# EAGLE design 6x5keyboard (EAGLE 6.5.0)
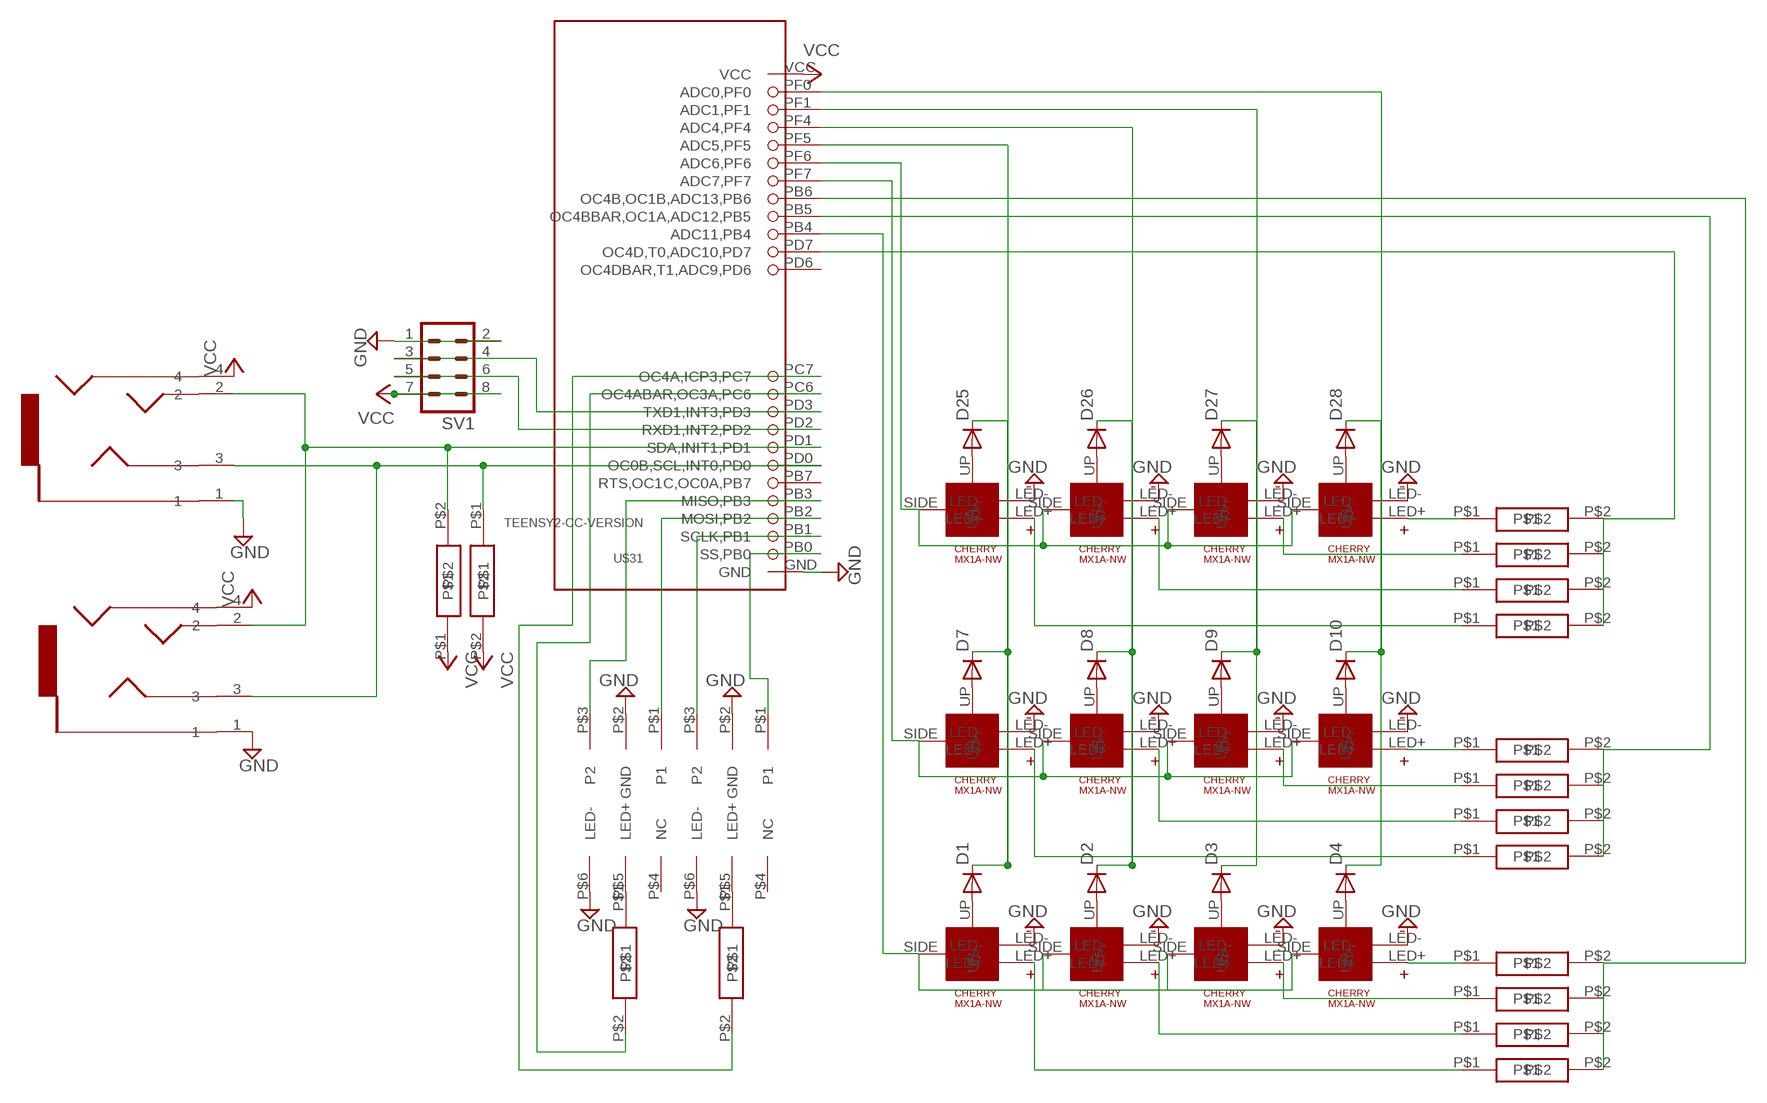
[diagram p0: schematic, sheet 1]

## Parts
COMM  SJ-43514_HEADPHONES_3.5MM_X4  [SJ-43514_HEADPHONES-3.5MM_X4]
COMM1  SJ-43514_HEADPHONES_3.5MM_X4  [SJ-43514_HEADPHONES-3.5MM_X4]
D1  1N4148DO35-7  [DO35-7]
D2  1N4148DO35-7  [DO35-7]
D3  1N4148DO35-7  [DO35-7]
D4  1N4148DO35-7  [DO35-7]
D7  1N4148DO35-7  [DO35-7]
D8  1N4148DO35-7  [DO35-7]
D9  1N4148DO35-7  [DO35-7]
D10  1N4148DO35-7  [DO35-7]
D25  1N4148DO35-7  [DO35-7]
D26  1N4148DO35-7  [DO35-7]
D27  1N4148DO35-7  [DO35-7]
D28  1N4148DO35-7  [DO35-7]
SV1  MA04-2  [MA04-2]
U$1  CHERRY-MX1A-E1NW-LED  [CHERRYMX-NN-LED]
U$2  CHERRY-MX1A-E1NW-LED  [CHERRYMX-NN-LED]
U$3  CHERRY-MX1A-E1NW-LED  [CHERRYMX-NN-LED]
U$4  CHERRY-MX1A-E1NW-LED  [CHERRYMX-NN-LED]
U$5  RESISTORBIGPAD  [RESISTORBIGPAD]
U$6  RESISTORBIGPAD  [RESISTORBIGPAD]
U$7  CHERRY-MX1A-E1NW-LED  [CHERRYMX-NN-LED]
U$8  CHERRY-MX1A-E1NW-LED  [CHERRYMX-NN-LED]
U$9  CHERRY-MX1A-E1NW-LED  [CHERRYMX-NN-LED]
U$10  CHERRY-MX1A-E1NW-LED  [CHERRYMX-NN-LED]
U$11  RESISTORBIGPAD  [RESISTORBIGPAD]
U$12  RESISTORBIGPAD  [RESISTORBIGPAD]
U$13  RESISTORBIGPAD  [RESISTORBIGPAD]
U$14  RESISTORBIGPAD  [RESISTORBIGPAD]
U$15  RESISTORBIGPAD  [RESISTORBIGPAD]
U$16  RESISTORBIGPAD  [RESISTORBIGPAD]
U$17  RESISTORBIGPAD  [RESISTORBIGPAD]
U$18  RESISTORBIGPAD  [RESISTORBIGPAD]
U$19  RESISTORBIGPAD  [RESISTORBIGPAD]
U$20  RESISTORBIGPAD  [RESISTORBIGPAD]
U$21  RESISTORBIGPAD  [RESISTORBIGPAD]
U$22  RESISTORBIGPAD  [RESISTORBIGPAD]
U$23  NKK_GW_SERIES  [NKK_GW_SERIES]
U$24  NKK_GW_SERIES  [NKK_GW_SERIES]
U$25  CHERRY-MX1A-E1NW-LED  [CHERRYMX-NN-LED]
U$26  CHERRY-MX1A-E1NW-LED  [CHERRYMX-NN-LED]
U$27  CHERRY-MX1A-E1NW-LED  [CHERRYMX-NN-LED]
U$28  CHERRY-MX1A-E1NW-LED  [CHERRYMX-NN-LED]
U$29  RESISTORBIGPAD  [RESISTORBIGPAD]
U$30  RESISTORBIGPAD  [RESISTORBIGPAD]
U$31  TEENSY2-CC-VERSION  [TEENSY2]

## Nets
GND: COMM1.1 COMM.1 SV1.1 SV1.2 U$1.LED- U$2.LED- U$3.LED- U$4.LED- U$7.LED- U$8.LED- U$9.LED- U$10.LED- U$23.P$2(GND) U$23.P$6(LED-) U$24.P$2(GND) U$24.P$6(LED-) U$25.LED- U$26.LED- U$27.LED- U$28.LED- U$31.GND
N$1: D1.A U$2.UP
N$2: D2.A U$1.UP
N$3: D3.A U$3.UP
N$4: D4.A U$4.UP
N$5: U$4.LED+ U$12.P$1
N$6: U$23.P$5(LED+) U$29.P$1
N$7: D7.A U$7.UP
N$8: D8.A U$8.UP
N$9: D9.A U$9.UP
N$10: D10.A U$10.UP
N$11: U$3.LED+ U$11.P$1
N$12: U$1.LED+ U$6.P$1
N$13: U$2.LED+ U$5.P$1
N$14: U$30.P$2 U$31.PC7(OC4A,ICP3,PC7)
N$15: U$24.P$5(LED+) U$30.P$1
N$16: COMM1.2 COMM.2 U$21.P$2 U$31.PD1(SDA,INIT1,PD1)
N$17: U$29.P$2 U$31.PC6(OC4ABAR,OC3A,PC6)
N$18: U$10.LED+ U$13.P$1
N$19: U$9.LED+ U$14.P$1
N$20: U$8.LED+ U$15.P$1
N$21: U$7.LED+ U$16.P$1
N$22: U$24.P$1(P1) U$31.PB0(SS,PB0)
N$23: U$17.P$1 U$28.LED+
N$24: U$18.P$1 U$27.LED+
N$25: D25.A U$25.UP
N$26: D26.A U$26.UP
N$27: D27.A U$27.UP
N$28: D28.A U$28.UP
N$29: U$19.P$1 U$26.LED+
N$30: U$20.P$1 U$25.LED+
N$31: D1.C D7.C D25.C U$31.PF5(ADC5,PF5)
N$32: D2.C D8.C D26.C U$31.PF4(ADC4,PF4)
N$33: D3.C D9.C D27.C U$31.PF1(ADC1,PF1)
N$34: D4.C D10.C D28.C U$31.PF0(ADC0,PF0)
N$35: U$24.P$3(P2) U$31.PB1(SCLK,PB1)
N$36: U$23.P$1(P1) U$31.PB2(MOSI,PB2)
N$37: SV1.3 SV1.4 U$31.PD3(TXD1,INT3,PD3)
N$38: U$1.SIDE(A) U$2.SIDE(A) U$3.SIDE(A) U$4.SIDE(A) U$31.PB4(ADC11,PB4)
N$39: U$7.SIDE(A) U$8.SIDE(A) U$9.SIDE(A) U$10.SIDE(A) U$31.PF7(ADC7,PF7)
N$40: U$25.SIDE(A) U$26.SIDE(A) U$27.SIDE(A) U$28.SIDE(A) U$31.PF6(ADC6,PF6)
N$41: SV1.5 SV1.6 U$31.PD2(RXD1,INT2,PD2)
N$42: U$23.P$3(P2) U$31.PB3(MISO,PB3)
N$49: U$5.P$2 U$6.P$2 U$11.P$2 U$12.P$2 U$31.PB6(OC4B,OC1B,ADC13,PB6)
N$50: U$13.P$2 U$14.P$2 U$15.P$2 U$16.P$2 U$31.PB5(OC4BBAR,OC1A,ADC12,PB5)
N$51: U$17.P$2 U$18.P$2 U$19.P$2 U$20.P$2 U$31.PD7(OC4D,T0,ADC10,PD7)
N$52: COMM1.3 COMM.3 U$22.P$1 U$31.PD0(OC0B,SCL,INT0,PD0)
VCC: COMM1.4 COMM.4 SV1.7 SV1.8 U$21.P$1 U$22.P$2 U$31.VCC
Unconnected: U$23.P$4(NC) U$24.P$4(NC) U$31.PB7(RTS,OC1C,OC0A,PB7) U$31.PD6(OC4DBAR,T1,ADC9,PD6)

## Library data of the parts
COMM COMM1 = my_parts:SJ-43514_HEADPHONES_3.5MM_X4: This is for the SJ-43514 3.5mm 4-conductor headphone jack. Also works with SJ-4351X and SJ-43515TS
D1-D4 D7-D10 D25-D28 = diode:1N4148: DIODE high speed (Philips)
SV1 = con-lstb:MA04-2: PIN HEADER; OC_FARNELL: unknown; OC_NEWARK: unknown
U$1-U$4 U$7-U$10 U$25-U$28 = my_parts:CHERRY-MX1A-E1NW-LED: A cherry MX NW switch, but also with a place to put a LED
U$5 U$6 U$11-U$22 U$29 U$30 = my_parts:RESISTORBIGPAD
U$23 U$24 = my_parts:NKK_GW_SERIES
U$31 = teensy2:TEENSY2-C

## Board
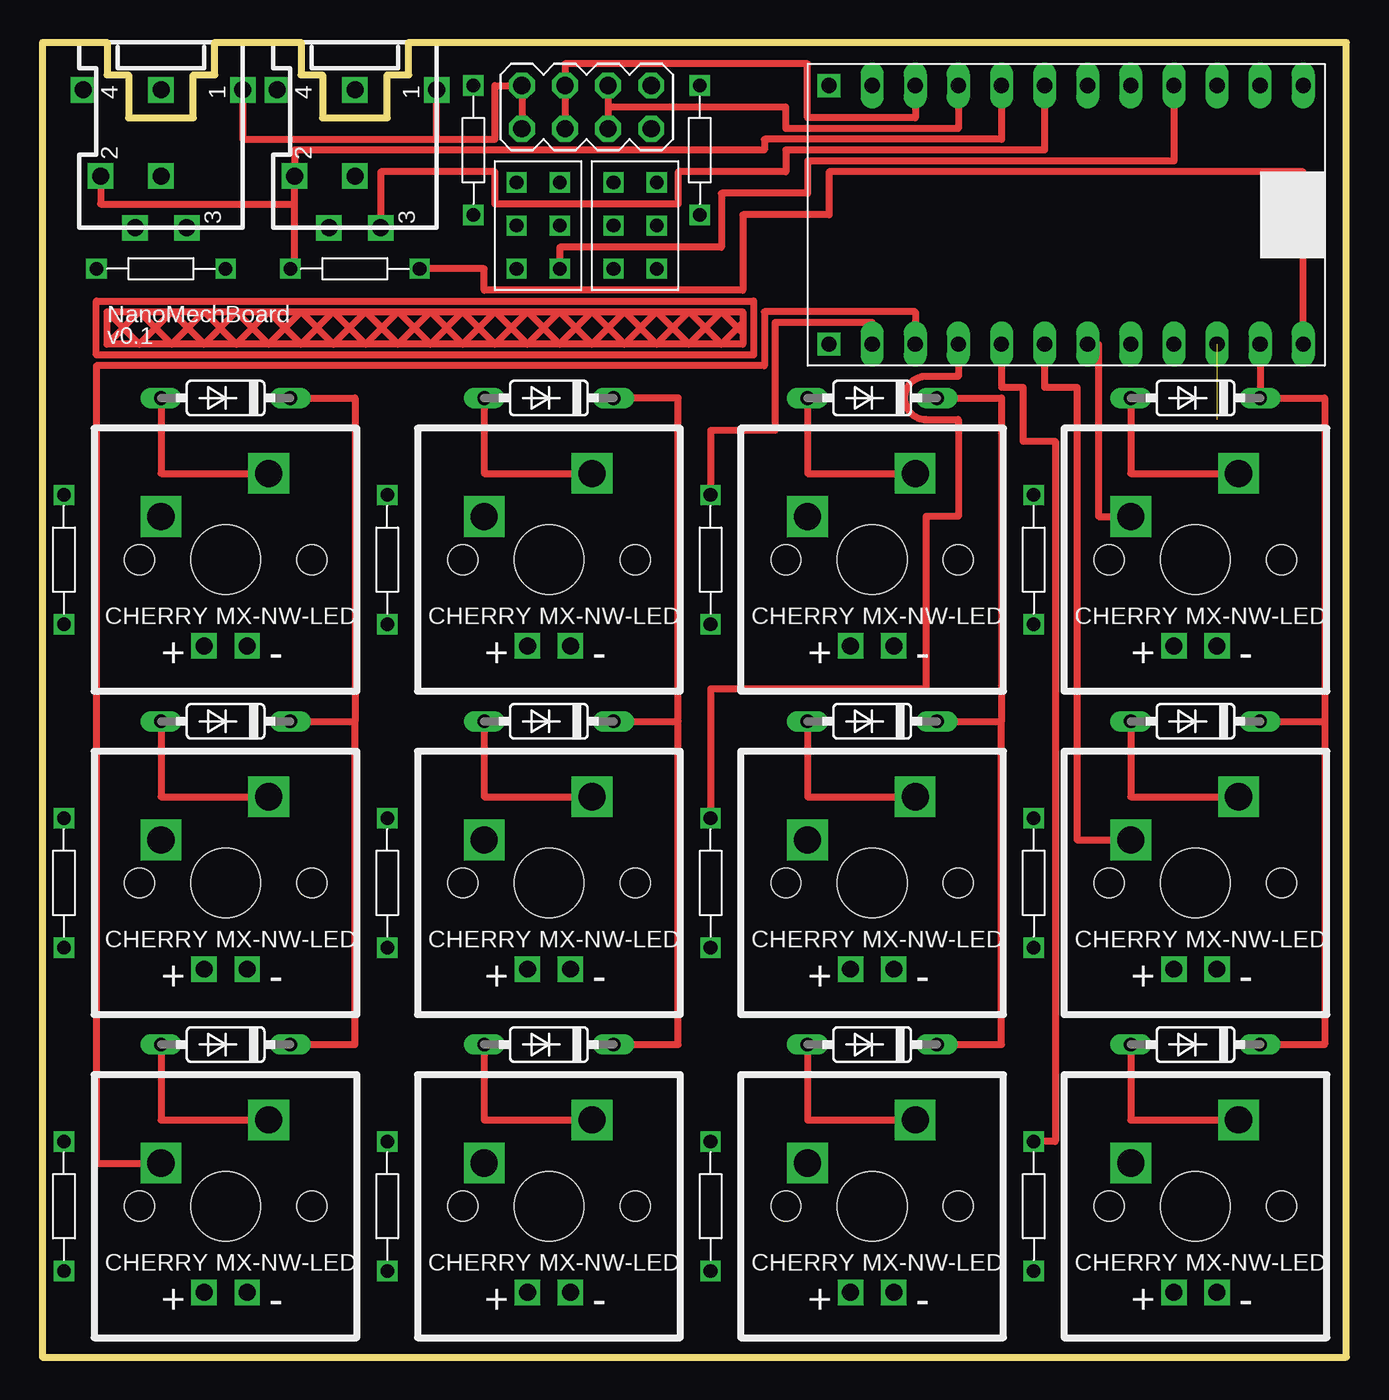
[diagram p1: board, top side]
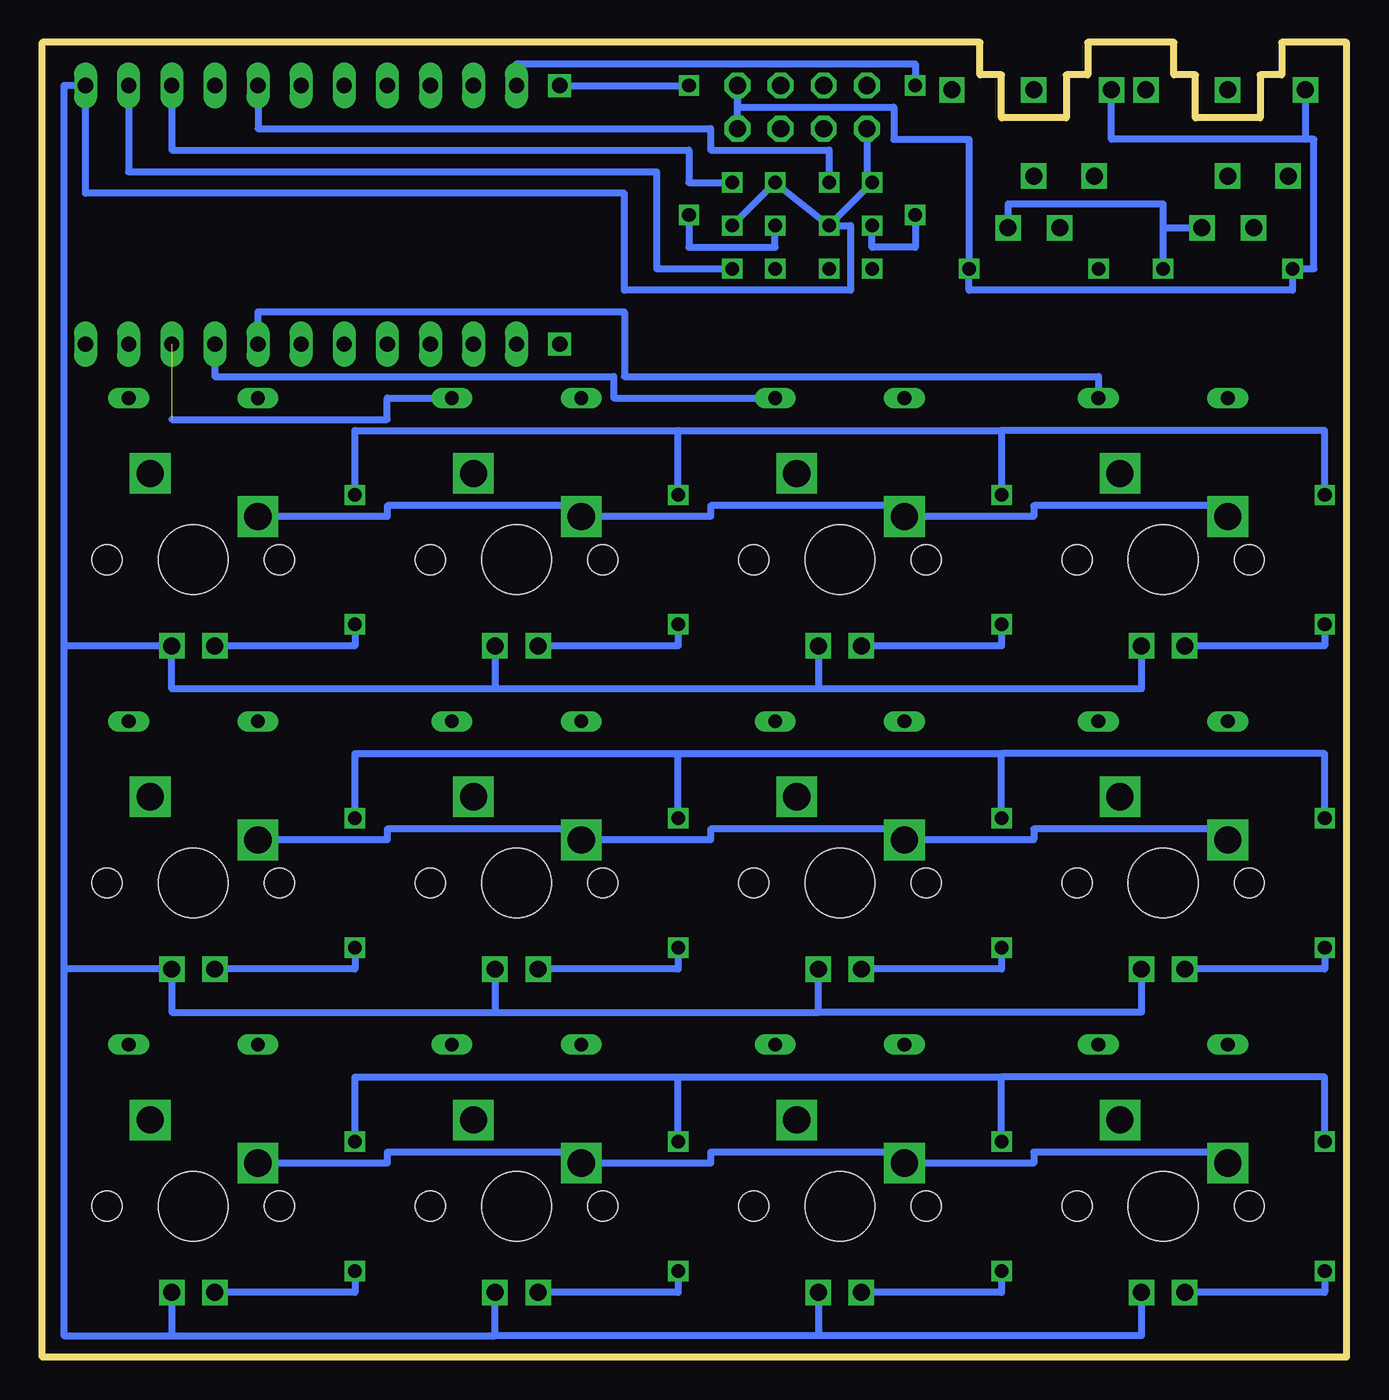
[diagram p2: board, bottom side, seen from below]

Size 76.84 x 77.47 mm. Coordinates in mm from the lower left corner, seen from the top.
Outline: 0,0 76.84,0 76.84,77.47 21.59,77.47 21.59,75.56 20.32,75.56 20.32,73.03 16.51,73.03 16.51,75.56 15.24,75.56 15.24,77.47 10.16,77.47 10.16,75.56 8.89,75.56 8.89,73.03 5.08,73.03 5.08,75.56 3.81,75.56 3.81,77.47 0,77.47 0,0
Copper layers (1*16): Top 0.0356mm / dielectric 1.5011mm / Bottom 0.0356mm
Design rules "LaenPCBOrder": minimum track width 6mil, minimum drill 13mil, track to track 6mil, track to pad 6mil, pad to pad 6mil, via to via 6mil, smd to smd 6mil, copper to edge 15mil, drill to drill 6mil, minimum pad ring 7mil, minimum via ring 7mil, stop-mask expansion 4mil, vias tented up to drill 0mil, thermal gap 10mil

### Footprints (pad centres in the part's own frame; a part is rotated, then mirrored left to right if it is on the bottom)
SJ-43514_HEADPHONES-3.5MM_X4 = drill 1 square: 1 0,4.826; 2 5.08,-3.556; 3 8.128,1.524; 4 0,-4.572; 5 8.128,-1.524; NC 0,0; NC2 5.08,0
DO35-7 = drill 0.813 long: A 3.81,0; C -3.81,0
MA04-2 = drill 1.016 octagon: 1 -3.81,-1.27; 2 -3.81,1.27; 3 -1.27,-1.27; 4 -1.27,1.27; 5 1.27,-1.27; 6 1.27,1.27; 7 3.81,-1.27; 8 3.81,1.27
CHERRYMX-NN-LED = drill 1 square: LED+ -1.27,-5.08; LED- 1.27,-5.08 | drill 1.6 square: SIDE -3.81,2.54; UP 2.54,5.08 | hole 1.753: -5.08,0; 5.08,0 | hole 4.089: 0,0
RESISTORBIGPAD = drill 0.8 square: P$1 -3.81,0; P$2 3.81,0
NKK_GW_SERIES = drill 0.8 square: P$1 -1.27,2.54; P$2 -1.27,0; P$3 -1.27,-2.54; P$4 1.27,2.54; P$5 1.27,0; P$6 1.27,-2.54
TEENSY2 = drill 0.9 long: GND -7.62,16.51; PB0 -7.62,13.97; PB1 -7.62,11.43; PB2 -7.62,8.89; PB3 -7.62,6.35; PB4 7.62,-6.35; PB5 7.62,-3.81; PB6 7.62,-1.27; PB7 -7.62,3.81; PC6 -7.62,-8.89; PD0 -7.62,1.27; PD1 -7.62,-1.27; PD2 -7.62,-3.81; PD3 -7.62,-6.35; PD7 7.62,-8.89; PF0 7.62,13.97; PF1 7.62,11.43; PF4 7.62,8.89; PF5 7.62,6.35; PF6 7.62,3.81; PF7 7.62,1.27; VCC 7.62,16.51 | drill 0.9 square: PC7 -7.62,-11.43; PD6 7.62,-11.43

### Placement (x,y rotation side)
COMM  18.41,74.68 270 top
COMM1  6.99,74.68 270 top
D1  10.8,18.41 180 top
D2  29.85,18.41 180 top
D3  48.9,18.41 180 top
D4  67.95,18.41 180 top
D7  10.8,37.46 180 top
D8  29.85,37.46 180 top
D9  48.9,37.46 180 top
D10  67.95,37.46 180 top
D25  10.8,56.51 180 top
D26  29.85,56.51 180 top
D27  48.9,56.51 180 top
D28  67.95,56.51 180 top
SV1  32.06,73.66 0 top
U$1  29.85,8.89 0 top
U$2  10.8,8.89 0 top
U$3  48.9,8.89 0 top
U$4  67.95,8.89 0 top
U$5  1.27,8.89 90 top
U$6  20.32,8.89 90 top
U$7  10.8,27.94 0 top
U$8  29.85,27.94 0 top
U$9  48.9,27.94 0 top
U$10  67.95,27.94 0 top
U$11  39.37,8.89 90 top
U$12  58.42,8.89 90 top
U$13  58.42,27.94 90 top
U$14  39.37,27.94 90 top
U$15  20.32,27.94 90 top
U$16  1.27,27.94 90 top
U$17  58.42,46.99 90 top
U$18  39.37,46.99 90 top
U$19  20.32,46.99 90 top
U$20  1.27,46.99 90 top
U$21  18.41,64.14 180 top
U$22  6.99,64.14 180 top
U$23  29.21,66.67 180 top
U$24  34.93,66.67 180 top
U$25  10.8,46.99 0 top
U$26  29.85,46.99 0 top
U$27  48.9,46.99 0 top
U$28  67.95,46.99 0 top
U$29  25.4,71.12 90 top
U$30  38.73,71.12 90 top
U$31  57.79,67.31 270 top

### Tracks (layer width: path | path; a pad name or v marks a point on that pad's centre or on a via)
GND
  Top 0.406: COMM1.1 11.81,71.76 23.24,71.76 | 23.24,71.76 COMM.1 | 23.24,71.76 26.67,71.76 26.67,74.93 SV1.2 SV1.1
  Bottom 0.406: U$2.LED- 12.07,1.27 31.11,1.27 | U$1.LED- 31.11,1.27 | 31.11,1.27 50.17,1.27 | 50.17,1.27 U$3.LED- | U$4.LED- 69.22,1.27 | 69.22,1.27 50.17,1.27 | U$7.LED- 12.07,20.32 31.11,20.32 | 31.11,20.32 U$8.LED- | U$9.LED- 50.17,20.32 | 50.17,20.32 31.11,20.32 | 50.17,20.32 69.22,20.32 U$10.LED- 75.56,22.86 | 75.56,22.86 75.56,1.27 69.22,1.27 | 75.56,41.91 U$28.LED- 69.22,39.37 50.17,39.37 | 75.56,41.91 75.56,22.86 | U$27.LED- 50.17,39.37 | U$26.LED- 31.11,39.37 | 31.11,39.37 50.17,39.37 | U$25.LED- 12.07,39.37 31.11,39.37 | 75.56,41.91 75.56,74.93 U$31.GND 74.3,68.58 42.55,68.58 42.55,62.87 29.21,62.87 29.21,66.67 U$23.P$2 | U$23.P$2 U$24.P$6 U$24.P$2 | U$23.P$2 U$23.P$6 28.25,69.22 SV1.1
N$1
  Top 0.406: D1.A 6.99,13.97 U$2.UP
N$2
  Top 0.406: D2.A 26.04,13.97 U$1.UP
N$3
  Top 0.406: D3.A 45.09,13.97 U$3.UP
N$4
  Top 0.406: D4.A 64.14,13.97 U$4.UP
N$5
  Bottom 0.406: U$12.P$1 58.42,3.81 U$4.LED+
N$6
  Bottom 0.406: U$29.P$1 25.4,65.41 27.94,65.41 U$23.P$5
N$7
  Top 0.406: D7.A 6.99,33.02 U$7.UP
N$8
  Top 0.406: D8.A 26.04,33.02 U$8.UP
N$9
  Top 0.406: D9.A 45.09,33.02 U$9.UP
N$10
  Top 0.406: D10.A 64.14,33.02 U$10.UP
N$11
  Bottom 0.406: U$11.P$1 39.37,3.81 U$3.LED+
N$12
  Bottom 0.406: U$6.P$1 20.32,3.81 U$1.LED+
N$13
  Bottom 0.406: U$5.P$1 1.27,3.81 U$2.LED+
N$14
  Bottom 0.406: U$31.PC7 U$30.P$2
N$15
  Bottom 0.406: U$30.P$1 38.73,65.41 33.66,65.41 U$24.P$5
N$16
  Top 0.406: U$21.P$2 14.86,64.14 14.86,67.95 | 14.86,67.95 COMM.2 14.86,71.12 42.55,71.12 42.55,71.76 56.52,71.76 U$31.PD1 | COMM1.2 3.43,67.95 14.86,67.95
N$17
  Bottom 0.406: U$31.PC6 48.9,76.2 25.4,76.2 U$29.P$2
N$18
  Bottom 0.406: U$13.P$1 58.42,22.86 U$10.LED+
N$19
  Bottom 0.406: U$14.P$1 39.37,22.86 U$9.LED+
N$20
  Bottom 0.406: U$15.P$1 20.32,22.86 U$8.LED+
N$21
  Bottom 0.406: U$16.P$1 1.27,22.86 U$7.LED+
N$22
  Bottom 0.406: U$31.PB0 71.76,69.85 40.64,69.85 40.64,64.14 U$24.P$1
N$23
  Bottom 0.406: U$17.P$1 58.42,41.91 U$28.LED+
N$24
  Bottom 0.406: U$18.P$1 39.37,41.91 U$27.LED+
N$25
  Top 0.406: D25.A 6.99,52.07 U$25.UP
N$26
  Top 0.406: D26.A 26.04,52.07 U$26.UP
N$27
  Top 0.406: D27.A 45.09,52.07 U$27.UP
N$28
  Top 0.406: D28.A 64.14,52.07 U$28.UP
N$29
  Bottom 0.406: U$19.P$1 20.32,41.91 U$26.LED+
N$30
  Bottom 0.406: U$20.P$1 1.27,41.91 U$25.LED+
N$31
  Top 0.406: D25.C 18.41,56.51 18.41,37.46 | D7.C 18.41,37.46 | D1.C 18.41,18.41 18.41,37.46
  Bottom 0.406: U$31.PF5 64.14,61.59 42.55,61.59 42.55,57.78 14.61,57.78 D25.C
N$32
  Top 0.406: D8.C 37.47,37.46 | 37.47,37.46 37.47,56.51 D26.C | D2.C 37.47,18.41 37.47,37.46
  Bottom 0.406: U$31.PF4 66.67,57.78 43.18,57.78 43.18,56.51 D26.C
N$33  (1 unrouted)
  Top 0.406: D27.C 56.52,56.51 56.52,37.46 | D9.C 56.52,37.46 | D3.C 56.52,18.41 56.52,37.46
  Bottom 0.406: 69.22,55.24 56.52,55.24 56.52,56.51 D27.C
N$34
  Top 0.406: D10.C 75.56,37.46 | 75.56,37.46 75.56,18.41 D4.C | 75.56,37.46 75.56,56.51 D28.C U$31.PF0
N$35
  Bottom 0.406: U$31.PB1 69.22,71.12 38.73,71.12 38.73,69.22 U$24.P$3
N$36
  Top 0.406: U$31.PB2 66.67,70.48 45.09,70.48 45.09,68.58 40.01,68.58 40.01,65.41 30.48,65.41 U$23.P$1
N$37
  Top 0.406: U$31.PD3 51.44,73.03 45.09,73.03 45.09,76.2 30.79,76.2 SV1.4 SV1.3
N$38
  Top 0.406: U$2.SIDE 3.17,11.43 3.17,58.42 42.55,58.42 42.55,61.59 51.44,61.59 U$31.PB4
  Bottom 0.406: U$2.SIDE 6.99,12.07 18.41,12.07 18.41,11.43 U$1.SIDE 26.04,12.07 37.47,12.07 37.47,11.43 U$3.SIDE 45.09,12.07 56.52,12.07 56.52,11.43 U$4.SIDE
N$39
  Top 0.406: U$31.PF7 59.05,57.15 60.96,57.15 60.96,30.48 U$10.SIDE
  Bottom 0.406: U$7.SIDE 6.99,31.11 18.41,31.11 18.41,30.48 U$8.SIDE 26.04,31.11 37.47,31.11 37.47,30.48 U$9.SIDE 45.09,31.11 56.52,31.11 56.52,30.48 U$10.SIDE
N$40
  Top 0.406: U$31.PF6 62.23,59.69 62.23,49.53 U$28.SIDE
  Bottom 0.406: U$25.SIDE 6.99,50.16 18.41,50.16 18.41,49.53 U$26.SIDE 26.04,50.16 37.47,50.16 37.47,49.53 U$27.SIDE 45.09,50.16 56.52,50.16 56.52,49.53 U$28.SIDE
N$41
  Top 0.406: U$31.PD2 53.98,72.39 43.82,72.39 43.82,73.66 33.34,73.66 | SV1.6 33.34,73.66 | 33.34,73.66 SV1.5
N$42
  Bottom 0.406: U$31.PB3 64.14,72.39 37.47,72.39 37.47,71.12 30.48,71.12 U$23.P$3
N$43
  Top 0.406: 3.17,62.23 41.91,62.23 41.91,59.05 3.17,59.05 3.17,62.23
N$44
  Top 0.406: 3.81,61.59 5.72,61.59 | 5.72,61.59 7.62,61.59 | 7.62,61.59 9.52,61.59 | 9.52,61.59 11.43,61.59 | 11.43,61.59 13.34,61.59 | 13.34,61.59 15.24,61.59 | 15.24,61.59 17.14,61.59 | 17.14,61.59 19.05,61.59 | 19.05,61.59 20.95,61.59 | 20.95,61.59 22.86,61.59 | 22.86,61.59 24.77,61.59 | 24.77,61.59 26.67,61.59 | 26.67,61.59 28.57,61.59 | 28.57,61.59 30.48,61.59 | 30.48,61.59 32.39,61.59 | 32.39,61.59 34.29,61.59 | 34.29,61.59 36.2,61.59 | 36.2,61.59 38.1,61.59 | 38.1,61.59 40.01,61.59 | 40.01,61.59 41.28,61.59 41.28,60.96 | 41.28,60.96 41.28,60.32 | 41.28,60.32 41.28,59.69 40.01,59.69 | 40.01,59.69 38.1,59.69 | 38.1,59.69 36.2,59.69 | 36.2,59.69 34.29,59.69 | 34.29,59.69 32.39,59.69 | 32.39,59.69 30.48,59.69 | 30.48,59.69 28.57,59.69 | 28.57,59.69 26.67,59.69 | 26.67,59.69 24.77,59.69 | 24.77,59.69 22.86,59.69 | 22.86,59.69 20.95,59.69 | 20.95,59.69 19.05,59.69 | 19.05,59.69 17.14,59.69 | 17.14,59.69 15.24,59.69 | 15.24,59.69 13.34,59.69 | 13.34,59.69 11.43,59.69 | 11.43,59.69 9.52,59.69 | 9.52,59.69 7.62,59.69 | 7.62,59.69 5.72,59.69 | 5.72,59.69 3.81,59.69 | 3.81,59.69 3.81,61.59 | 3.81,61.59 5.72,59.69 | 5.72,59.69 7.62,61.59 | 7.62,61.59 9.52,59.69 | 9.52,59.69 11.43,61.59 | 11.43,61.59 13.34,59.69 | 13.34,59.69 15.24,61.59 | 15.24,61.59 17.14,59.69 | 17.14,59.69 19.05,61.59 | 19.05,61.59 20.95,59.69 | 20.95,59.69 22.86,61.59 | 22.86,61.59 24.77,59.69 | 24.77,59.69 26.67,61.59 | 26.67,61.59 28.57,59.69 | 28.57,59.69 30.48,61.59 | 30.48,61.59 32.39,59.69 | 32.39,59.69 34.29,61.59 | 34.29,61.59 36.2,59.69 | 36.2,59.69 38.1,61.59 | 38.1,61.59 40.01,59.69 | 40.01,59.69 41.28,60.96 | 5.72,61.59 7.62,59.69 | 5.72,61.59 3.81,59.69 | 7.62,59.69 9.52,61.59 | 9.52,61.59 11.43,59.69 | 11.43,59.69 13.34,61.59
  Top 0.406: 13.34,61.59 15.24,59.69 | 15.24,59.69 17.14,61.59 | 17.14,61.59 19.05,59.69 | 19.05,59.69 20.95,61.59 | 20.95,61.59 22.86,59.69 | 22.86,59.69 24.77,61.59 | 24.77,61.59 26.67,59.69 | 26.67,59.69 28.57,61.59 | 28.57,61.59 30.48,59.69 | 30.48,59.69 32.39,61.59 | 32.39,61.59 34.29,59.69 | 34.29,59.69 36.2,61.59 | 36.2,61.59 38.1,59.69 | 38.1,59.69 40.01,61.59 | 40.01,61.59 41.28,60.32
N$49
  Top 0.406: U$31.PB6 56.52,57.15 57.79,57.15 57.79,53.97 59.69,53.97 59.69,12.7 U$12.P$2
  Bottom 0.406: U$5.P$2 1.27,16.51 20.32,16.51 | U$6.P$2 20.32,16.51 | U$11.P$2 39.37,16.51 | 39.37,16.51 20.32,16.51 | U$12.P$2 58.42,16.51 39.37,16.51
N$50
  Top 0.406: U$31.PB5 53.98,57.78 52.07,57.78 arc90 50.8,56.51 arc90 52.07,55.24 53.98,55.24 53.98,49.53 52.07,49.53 52.07,39.37 39.37,39.37 U$14.P$2
  Bottom 0.406: U$16.P$2 1.27,35.56 20.32,35.56 | U$15.P$2 20.32,35.56 | U$14.P$2 39.37,35.56 | 39.37,35.56 20.32,35.56 | U$13.P$2 58.42,35.56 39.37,35.56
N$51
  Top 0.406: U$31.PD7 48.9,60.96 43.18,60.96 43.18,54.61 39.37,54.61 U$18.P$2
  Bottom 0.406: U$20.P$2 1.27,54.61 20.32,54.61 | 20.32,54.61 U$19.P$2 | U$18.P$2 39.37,54.61 | 39.37,54.61 20.32,54.61 | U$17.P$2 58.42,54.61 39.37,54.61
N$52
  Top 0.406: U$31.PD0 59.05,71.12 43.82,71.12 43.82,69.85 37.47,69.85 37.47,67.95 26.67,67.95 26.67,69.85 19.94,69.85 COMM.3
  Bottom 0.406: 10.8,66.55 COMM1.3 | U$22.P$1 10.8,66.55 | 10.8,66.55 10.8,67.95 19.94,67.95 COMM.3
VCC
  Top 0.406: U$31.VCC 74.3,69.85 46.36,69.85 46.36,67.31 41.28,67.31 41.28,62.87 26.04,62.87 26.04,64.14 U$21.P$1
  Bottom 0.406: COMM1.4 2.41,71.76 | 2.41,71.76 13.84,71.76 COMM.4 | 2.41,71.76 1.91,71.76 1.91,64.14 U$22.P$2 3.17,62.87 22.22,62.87 U$21.P$1 22.22,71.76 26.67,71.76 26.67,73.66 35.88,73.66 SV1.8 SV1.7

### Text on the board
tPlace: NanoMechBoard | v0.1